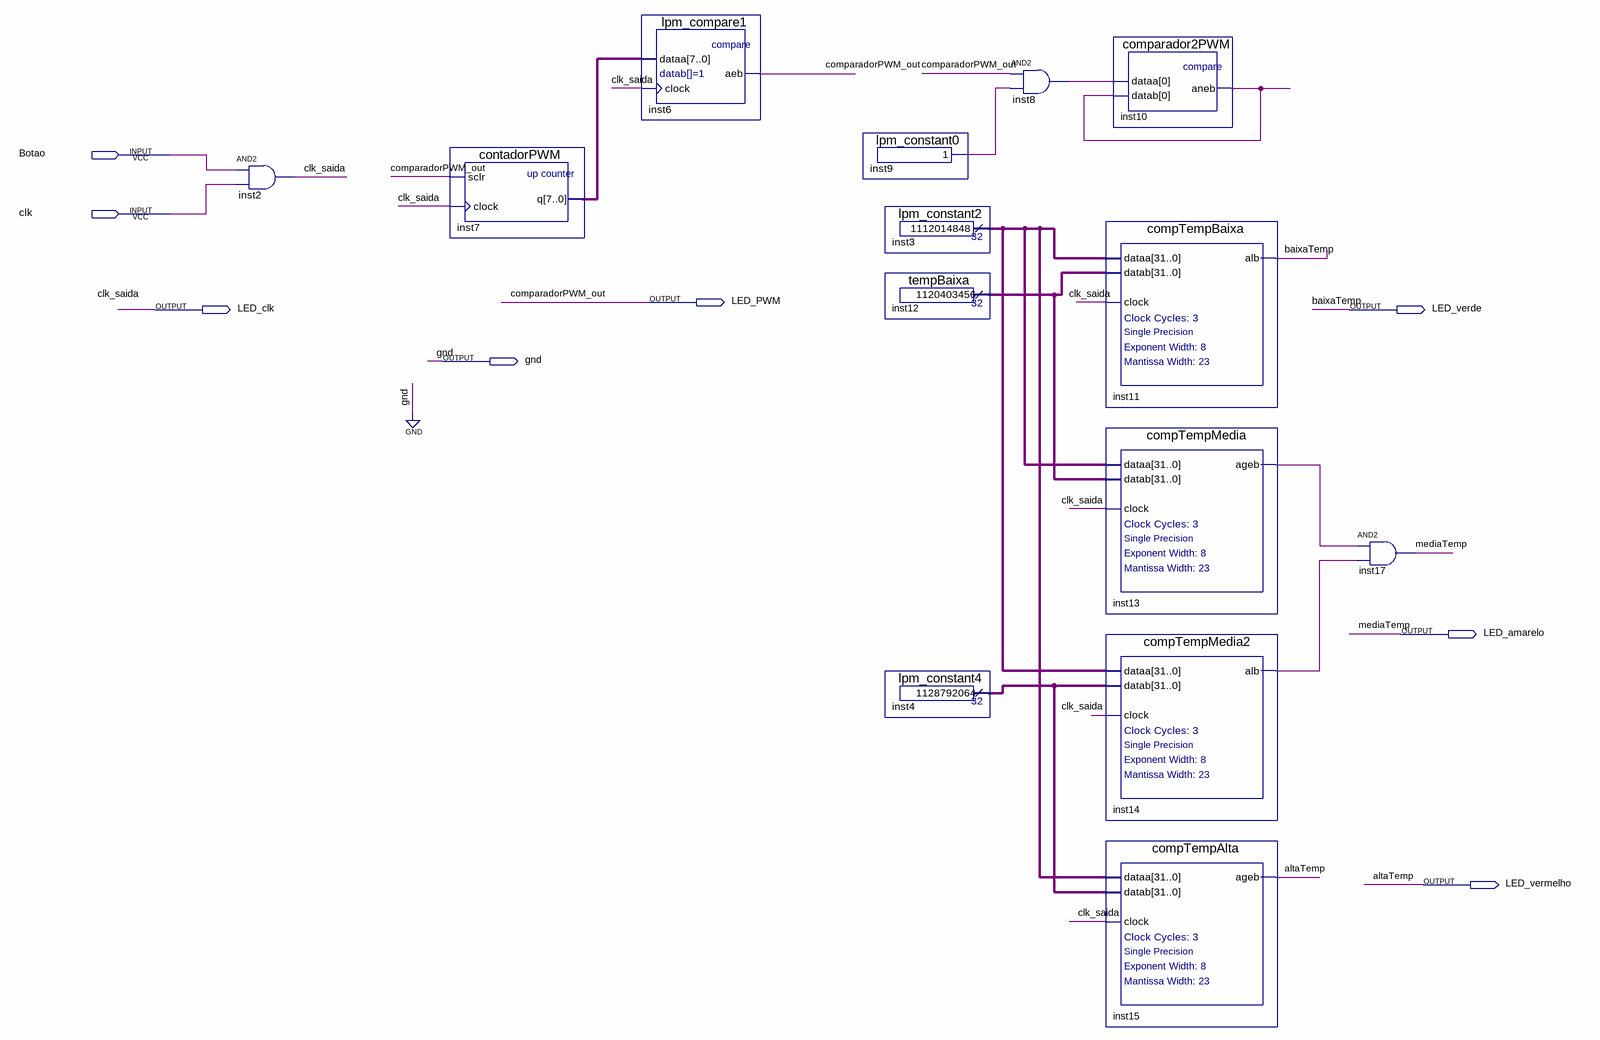
[diagram p0: schematic sheet]
// Quartus schematic controle_incendio.bdf as structural Verilog: 14 symbols, 8 pins
module controle_incendio (
  input  Botao,
  input  clk,
  output LED_PWM,
  output LED_clk,
  output LED_verde,
  output gnd,
  output LED_amarelo,
  output LED_vermelho
);

  wire inst8_out, inst9_result, inst10_aneb, inst13_ageb, inst14_alb;
  wire [7:0] inst7_q;
  wire [31:0] inst3_result, inst4_result, inst12_result;

  and inst2 (LED_clk, Botao, clk);
  contadorPWM inst7 (.sclr(LED_PWM), .clock(LED_clk), .q(inst7_q));
  lpm_compare1 inst6 (.dataa(inst7_q), .clock(LED_clk), .aeb(LED_PWM));
  lpm_constant0 inst9 (.result(inst9_result));
  lpm_constant2 inst3 (.result(inst3_result));
  tempBaixa inst12 (.result(inst12_result));
  lpm_constant4 inst4 (.result(inst4_result));
  and inst8 (inst8_out, LED_PWM, inst9_result);
  comparador2PWM inst10 (.dataa(inst8_out), .datab(inst10_aneb), .aneb(inst10_aneb));
  compTempBaixa inst11 (.dataa(inst3_result), .datab(inst12_result), .clock(LED_clk), .alb(LED_verde));
  compTempMedia inst13 (.dataa(inst3_result), .datab(inst12_result), .clock(LED_clk), .ageb(inst13_ageb));
  compTempMedia2 inst14 (.dataa(inst3_result), .datab(inst4_result), .clock(LED_clk), .alb(inst14_alb));
  compTempAlta inst15 (.dataa(inst3_result), .datab(inst4_result), .clock(LED_clk), .ageb(LED_vermelho));
  and inst17 (LED_amarelo, inst13_ageb, inst14_alb);

  assign gnd = 1'b0;

  // Other names for the same wires on the sheet: altaTemp = LED_vermelho; baixaTemp = LED_verde; clk_saida = LED_clk;
  //   comparadorPWM_out = LED_PWM; mediaTemp = LED_amarelo
endmodule
